# Altium schematic sheet CAN.SchDoc
size A; SheetNumber: 2; SheetTotal: 3
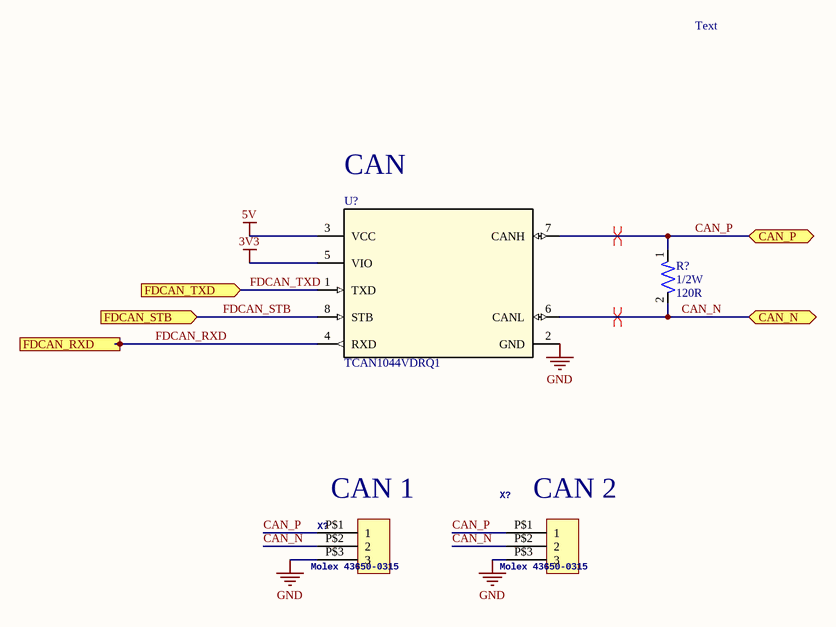
[diagram p0: CAN.SchDoc]

## Parts
(Parts that share a designator on the sheet are numbered #1, #2 ... from top to bottom, then left to right.)
R?  Power: 1/2W  Resistance: 120R  [RES-1210]  (hidden comment: RC1210FR-07120RL)
U?  TCAN1044VDRQ1  [IC-8SOIC]
X?#1  Molex 43650-0315  [43650-0315]
X?#2  Molex 43650-0315  [43650-0315]

## Ports
CAN_N (bidir), CAN_P (bidir), FDCAN_RXD (out), FDCAN_STB (in), FDCAN_TXD (in)

## Nets
3V3: U?.5(VIO)
5V: U?.3(VCC)
GND: U?.2(GND) X?#1.P$3(3) X?#2.P$3(3)
CAN_N: R?.2 U?.6(CANL) X?#1.P$2(2) X?#2.P$2(2) ; port CAN_N
CAN_P: R?.1 U?.7(CANH) X?#1.P$1(1) X?#2.P$1(1) ; port CAN_P
FDCAN_RXD: U?.4(RXD) ; port FDCAN_RXD
FDCAN_STB: U?.8(STB) ; port FDCAN_STB
FDCAN_TXD: U?.1(TXD) ; port FDCAN_TXD

## Layout directives
differential pair: CAN_N, CAN_P

## Notes on the sheet
- Text
- CAN
- (near X?#1) CAN 1
- (near X?#2) CAN 2

## Library data of the parts
R? = RES-120-0001: RES 120 OHM 1% 1/2W 1210; Tolerance: 1%; Size: 1210; ComponentLink1Description: Datasheet; ComponentLink1URL: https://www.yageo.com/upload/media/product/products/datasheet/rchip/PYu-RC_Group_51_RoHS_L_12.pdf
U? = IC-CAN-0001: IC TRANSCEIVER 1/1 8SOIC; ComponentLink1Description: Datasheet; ComponentLink1URL: https://www.ti.com/lit/ds/symlink/tcan1044-q1.pdf?HQS=dis-dk-null-digikeymode-dsf-pf-null-wwe&ts=1728758303289&ref_url=https%253A%252F%252Fwww.ti.com%252Fgeneral%252Fdocs%252Fsuppproductinfo.tsp%253FdistId%253D10%2526gotoUrl%253Dhttps%253A%252F%252Fwww.ti.com%252Flit%252Fgpn%252Ftcan1044-q1
X?#1 X?#2 = Micro-Fit Molex 3 Pin Vertical: GateName_1: G$1; SymbolName_1: HEADER_POS3; DeviceSetName: HEADER_POS3_?; DeviceName: 43650-0315; LibraryName: con-molex-micro-fit-3_0_2; Package: 43650-0315